# Altium schematic sheet tsal.SchDoc: tsal-illumination
size A4; Date: 05.10.2017; CheckedBy: UNCHECKED; Author: Leon Loeser; Organization: Baltic Racing; Address1: Zur Schwedenschanze 15; Address2: Haus 18; Address3: 18435 Stralsund; Revision: 1.0; SheetNumber: 1; SheetTotal: 1; Rules: EV4.10, T11.9; ProjectName: Projekt
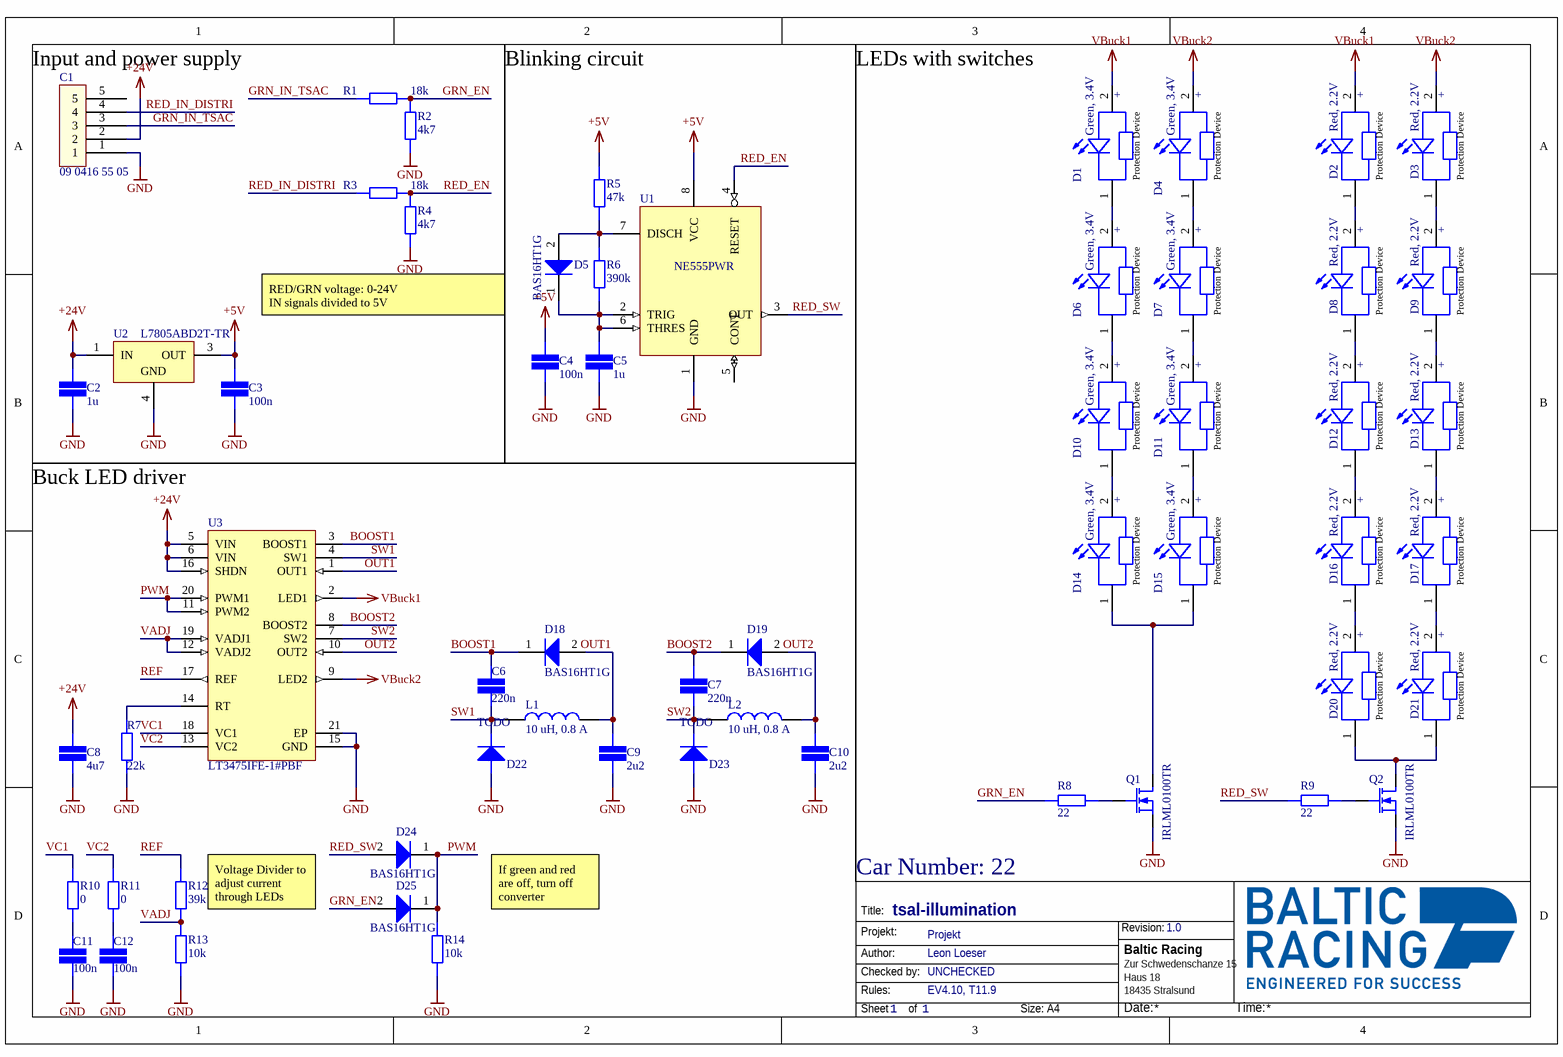
[diagram p0: tsal.SchDoc]

## Parts
C1  09 0416 55 05  [BINDER_09_0416_30_05]
C2  value 1u  [CAP 0805/2012]  (hidden comment: SMD Capacitor)
C3  value 100n  [CAP 0603/1608]  (hidden comment: SMD Capacitor)
C4  value 100n  [CAP 0603/1608]  (hidden comment: SMD Capacitor)
C5  value 1u  [CAP 0805/2012]  (hidden comment: SMD Capacitor)
C6  value 220n  [CAP 0603/1608]  (hidden comment: SMD Capacitor)
C7  value 220n  [CAP 0603/1608]  (hidden comment: SMD Capacitor)
C8  value 4u7  [CAP 1206/3216]  (hidden comment: SMD Capacitor)
C9  value 2u2  [CAP 1206/3216]  (hidden comment: SMD Capacitor)
C10  value 2u2  [CAP 1206/3216]  (hidden comment: SMD Capacitor)
C11  value 100n  [CAP 0603/1608]  (hidden comment: SMD Capacitor)
C12  value 100n  [CAP 0603/1608]  (hidden comment: SMD Capacitor)
D1  Green, 3.4V  [WL-SMDC_3535]
D2  Red, 2.2V  [WL-SMDC_3535]
D3  Red, 2.2V  [WL-SMDC_3535]
D4  Green, 3.4V  [WL-SMDC_3535]
D5  BAS16HT1G  [ONSC-SOD-323-2-477-02_V]
D6  Green, 3.4V  [WL-SMDC_3535]
D7  Green, 3.4V  [WL-SMDC_3535]
D8  Red, 2.2V  [WL-SMDC_3535]
D9  Red, 2.2V  [WL-SMDC_3535]
D10  Green, 3.4V  [WL-SMDC_3535]
D11  Green, 3.4V  [WL-SMDC_3535]
D12  Red, 2.2V  [WL-SMDC_3535]
D13  Red, 2.2V  [WL-SMDC_3535]
D14  Green, 3.4V  [WL-SMDC_3535]
D15  Green, 3.4V  [WL-SMDC_3535]
D16  Red, 2.2V  [WL-SMDC_3535]
D17  Red, 2.2V  [WL-SMDC_3535]
D18  BAS16HT1G  [ONSC-SOD-323-2-477-02_V]
D19  BAS16HT1G  [ONSC-SOD-323-2-477-02_V]
D20  Red, 2.2V  [WL-SMDC_3535]
D21  Red, 2.2V  [WL-SMDC_3535]
D22  TODO  [SOD123F]
D23  TODO  [SOD123F]
D24  BAS16HT1G  [ONSC-SOD-323-2-477-02_V]
D25  BAS16HT1G  [ONSC-SOD-323-2-477-02_V]
L1  10 uH, 0.8 A  [WE-LQSH_2512]
L2  10 uH, 0.8 A  [WE-LQSH_2512]
Q1  IRLML0100TR  [SOT23]
Q2  IRLML0100TR  [SOT23]
R1  value 18k  [STACKPOLE CSR0603]  (hidden comment: SMD Resistor)
R2  value 4k7  [STACKPOLE CSR0603]  (hidden comment: SMD Resistor)
R3  value 18k  [STACKPOLE CSR0603]  (hidden comment: SMD Resistor)
R4  value 4k7  [STACKPOLE CSR0603]  (hidden comment: SMD Resistor)
R5  value 47k  [STACKPOLE CSR0603]  (hidden comment: SMD Resistor)
R6  value 390k  [STACKPOLE CSR0603]  (hidden comment: SMD Resistor)
R7  value 22k  [STACKPOLE CSR0603]  (hidden comment: SMD Resistor)
R8  value 22  [STACKPOLE CSR0603]  (hidden comment: SMD Resistor)
R9  value 22  [STACKPOLE CSR0603]  (hidden comment: SMD Resistor)
R10  value 0  [STACKPOLE CSR0603]  (hidden comment: SMD Resistor)
R11  value 0  [STACKPOLE CSR0603]  (hidden comment: SMD Resistor)
R12  value 39k  [STACKPOLE CSR0603]  (hidden comment: SMD Resistor)
R13  value 10k  [STACKPOLE CSR0603]  (hidden comment: SMD Resistor)
R14  value 10k  [STACKPOLE CSR0603]  (hidden comment: SMD Resistor)
U1  NE555PWR  [8-TSSOP]
U2  L7805ABD2T-TR  [TO-263_M]
U3  LT3475IFE-1#PBF  [LT-FE-20-EPV-CB_L]

## Nets
+5V: C3.2 C4.2 R5.2 U1.8(VCC) U2.3(OUT)
+24V: C1.2 C2.2 C8.2 U2.1(IN) U3.5(VIN) U3.6(VIN) U3.16(SHDN)
GND: C1.1 C2.1 C3.1 C4.1 C5.2 C8.1 C9.1 C10.1 C11.1 C12.1 D22.A D23.A Q1.2(S) Q2.2(S) R2.1 R4.1 R7.2 R13.2 R14.2 U1.1(GND) U2.4(GND) U3.15(GND) U3.21(EP)
VBuck1: D1.2(A) D2.2(A) U3.2(LED1)
VBuck2: D3.2(A) D4.2(A) U3.9(LED2)
BOOST1: C6.2 D18.1(K) U3.3(BOOST1)
BOOST2: C7.2 D19.1(K) U3.8(BOOST2)
GRN_EN: D25.2(A) R1.2 R2.2 R8.2
GRN_IN_TSAC: C1.3 R1.1
OUT1: C9.2 D18.2(A) L1.2 U3.1(OUT1)
OUT2: C10.2 D19.2(A) L2.2 U3.10(OUT2)
PWM: D24.1(K) D25.1(K) R14.1 U3.11(PWM2) U3.20(PWM1)
RED_EN: R3.2 R4.2 U1.4(RESET)
RED_IN_DISTRI: C1.4 R3.1
RED_SW: D24.2(A) R9.2 U1.3(OUT)
REF: R12.1 U3.17(REF)
SW1: C6.1 D22.C L1.1 U3.4(SW1)
SW2: C7.1 D23.C L2.1 U3.7(SW2)
VADJ: R12.2 R13.1 U3.12(VADJ2) U3.19(VADJ1)
VC1: R10.1 U3.18(VC1)
VC2: R11.1 U3.13(VC2)
NetC5_1: C5.1 D5.1(K) R6.1 U1.2(TRIG) U1.6(THRES)
NetC11_2: C11.2 R10.2
NetC12_2: C12.2 R11.2
NetD1_1: D1.1(K) D6.2(A)
NetD2_1: D2.1(K) D8.2(A)
NetD3_1: D3.1(K) D9.2(A)
NetD4_1: D4.1(K) D7.2(A)
NetD5_2: D5.2(A) R5.1 R6.2 U1.7(DISCH)
NetD6_1: D6.1(K) D10.2(A)
NetD7_1: D7.1(K) D11.2(A)
NetD8_1: D8.1(K) D12.2(A)
NetD9_1: D9.1(K) D13.2(A)
NetD10_1: D10.1(K) D14.2(A)
NetD11_1: D11.1(K) D15.2(A)
NetD12_1: D12.1(K) D16.2(A)
NetD13_1: D13.1(K) D17.2(A)
NetD14_1: D14.1(K) D15.1(K) Q1.3(D)
NetD16_1: D16.1(K) D20.2(A)
NetD17_1: D17.1(K) D21.2(A)
NetD20_1: D20.1(K) D21.1(K) Q2.3(D)
NetQ1_1: Q1.1(G) R8.1
NetQ2_1: Q2.1(G) R9.1
NetR7_1: R7.1 U3.14(RT)

Not connected (* = marked no-connect by the designer): C1 5; U1 5(CONT)

## Notes on the sheet
- (near C1) Input and power supply
- Blinking circuit
- LEDs with switches
- RED/GRN voltage: 0-24V
  IN signals divided to 5V
- Buck LED driver
- Voltage Divider to adjust current through LEDs
- If green and red are off, turn off converter
- Car Number: 22
- Title:
- Projekt:
- Revision:
- Author:
- Rules:
- Checked by:
- Sheet
- of
- Size:
- A4
- Date:
- Time:
- (in symbol 150353GS74500) +; Protection Device
- (in symbol 150353RS74500) +; Protection Device

## Library data of the parts
C1 = 09 0416 55 05: Binder 5 Pin Female SnapIn 90°
C2 C6-C12 = SMD Capacitor: Capacitor with multiple Footprints; Voltage: 25V
C3-C5 = SMD Capacitor: Capacitor with multiple Footprints; Voltage: 6.3V
D1 D4 D6 D7 D10 D11 D14 D15 = 150353GS74500: WL-SMDC SMT Mono-color Ceramic LED Waterclear, size 3535, 3.4V, Green; Manufacturer: Wurth Elektronik; Viewing Angle: 125deg; Peak Wavelength: 520nm; Chip Technology: InGaN; ComponentLink1Description: Manufacturer; ComponentLink1URL: http://www.we-online.de; ComponentLink2Description: Datasheet; ComponentLink2URL: https://katalog.we-online.de/led/datasheet/150353GS74500.pdf; Published Date: October 2019; Size: 3535; Forward Voltage: 3.4V; Operating Temperature: -40 to +125degC; Emitting Color: Green; Mounting Technology: SMT; Manufacturer Part Number: 150353GS74500; Packaging: Tape and Reel
D2 D3 D8 D9 D12 D13 D16 D17 D20 D21 = 150353RS74500: WL-SMDC SMT Mono-color Ceramic LED Waterclear, size 3535, 2.2V, Red; Manufacturer: Wurth Elektronik; Peak Wavelength: 635nm; Viewing Angle: 125deg; Chip Technology: AlInGaP; ComponentLink1Description: Manufacturer; ComponentLink1URL: http://www.we-online.de; ComponentLink2Description: Datasheet; ComponentLink2URL: https://katalog.we-online.de/led/datasheet/150353RS74500.pdf; Operating Temperature: -40 to +125degC; Emitting Color: Red; Forward Voltage: 2.2V; Manufacturer Part Number: 150353RS74500; Packaging: Tape and Reel; Mounting Technology: SMT; Published Date: October 2019; Size: 3535
D5 D18 D19 D24 D25 = CMP-1054-00068-1: Switching Diode, 2-Pin SOD-323, Pb-Free, Tape and Reel; Manufacturer: On Semiconductor; Configuration: Single; IF Max (A): 0.2; trr Max (ns): 6; Packing: Tape and Reel; ComponentLink2URL: http://www.onsemi.com/pub_link/Collateral/BAS16HT1-D.PDF; ComponentLink3Description: Package Specification; RoHS: TRUE; PackageDescription: 2-Pin SOD, Body 1.7 x 1.25 mm; PackageReference: SOD-323-2-477-02; PartNumber: BAS16HT1G; ComponentLink1URL: http://www.onsemi.com/; Mounting Technology: Surface Mount; ComponentLink1Description: Manufacturer URL; ComponentLink2Description: Datasheet; DatasheetVersion: Rev. 11; PackageVersion: Rev. H, 03/2007; ComponentLink3URL: http://www.onsemi.com/pub_link/Collateral/477-02.PDF.1
D22 D23 = SMD Diode: pin to pad: A>1 C>2
L1 L2 = 74405024100: SMT Semi-Shielded High Saturation Power Inductor WE-LQSH, size 2512, 10 uH, 0.8 A; Rated Current: 0.8 A; Inductance: 10 uH; DC Resistance max.: 522 mOhm; Self Resonant Frequency: 20 MHz; Saturation Current: 1.2 A; Peak Voltage max.: 25 V; ComponentLink1Description: Manufacturer; ComponentLink1URL: http://www.we-online.de; ComponentLink2Description: Datasheet; ComponentLink2URL: https://katalog.we-online.de/pbs/datasheet/74405024100.pdf; Part Number: 74405024100; Published Date: November 2018; Publisher: Wurth Elektronik; Size: 2512; Operating Temperature: -40 to +125 degC; Mounting Technology: SMT; Packaging: Tape and Reel
Q1 Q2 = MOSFET N: N-Channel MOSFET
R1-R14 = SMD Resistor: Resistor with multiple footprints
U1 = NE555
U2 = CMP-0244-00199-1: Positive Voltage Regulator, 3-Pin D2PAK, Tape and Reel; ComponentLink1Description: Manufacturer URL; ComponentLink1URL: http://www.st.com; ComponentLink2URL: http://www.st.com/internet/com/TECHNICAL_RESOURCES/TECHNICAL_LITERATURE/DATASHEET/CD00000444.pdf; PackageDescription: 3-Pin Transistor Outline Package 2.54 mm Pitch, 15.4 mm Lead Span (D2PAK); PackageVersion: 2011; PackageReference: TO-263; DatasheetVersion: 16/11/2011; ComponentLink2Description: Datasheet
U3 = CMP-0477-00152-1: Dual Step-Down 1.5 A LED Driver, 4 to 36 V Vin, 25 V Vout MAX, 20-pin SOP (FE-20-EPV-CB), -40 to 125 degC, Pb-Free; Manufacturer: Linear Technology; Topology: Buck, LED Driver; Vin Min(V): 4; RoHS: TRUE; Mounting Technology: Surface Mount; PackageReference: FE-20; PackageDescription: 20-Pin Plastic TSSOP, Body 6.5 x 4.4 mm, Pitch 0.65 mm; ComponentLink1URL: http://www.linear.com/; ComponentLink3Description: Package Specification; ComponentLink3URL: http://cds.linear.com/docs/en/packaging/05081663__J_FE20(CB).pdf; ComponentLink2URL: http://cds.linear.com/docs/en/datasheet/3475fb.pdf; PartNumber: LT3475IFE-1#PBF; ComponentLink1Description: Manufacturer URL; PackageVersion: Rev. I, 05/2011; DatasheetVersion: Rev. B; ComponentLink2Description: Datasheet